# EAGLE design TR_i3_6A_Module_v10 (EAGLE 9.6.2)

## Sheet 1 of 2
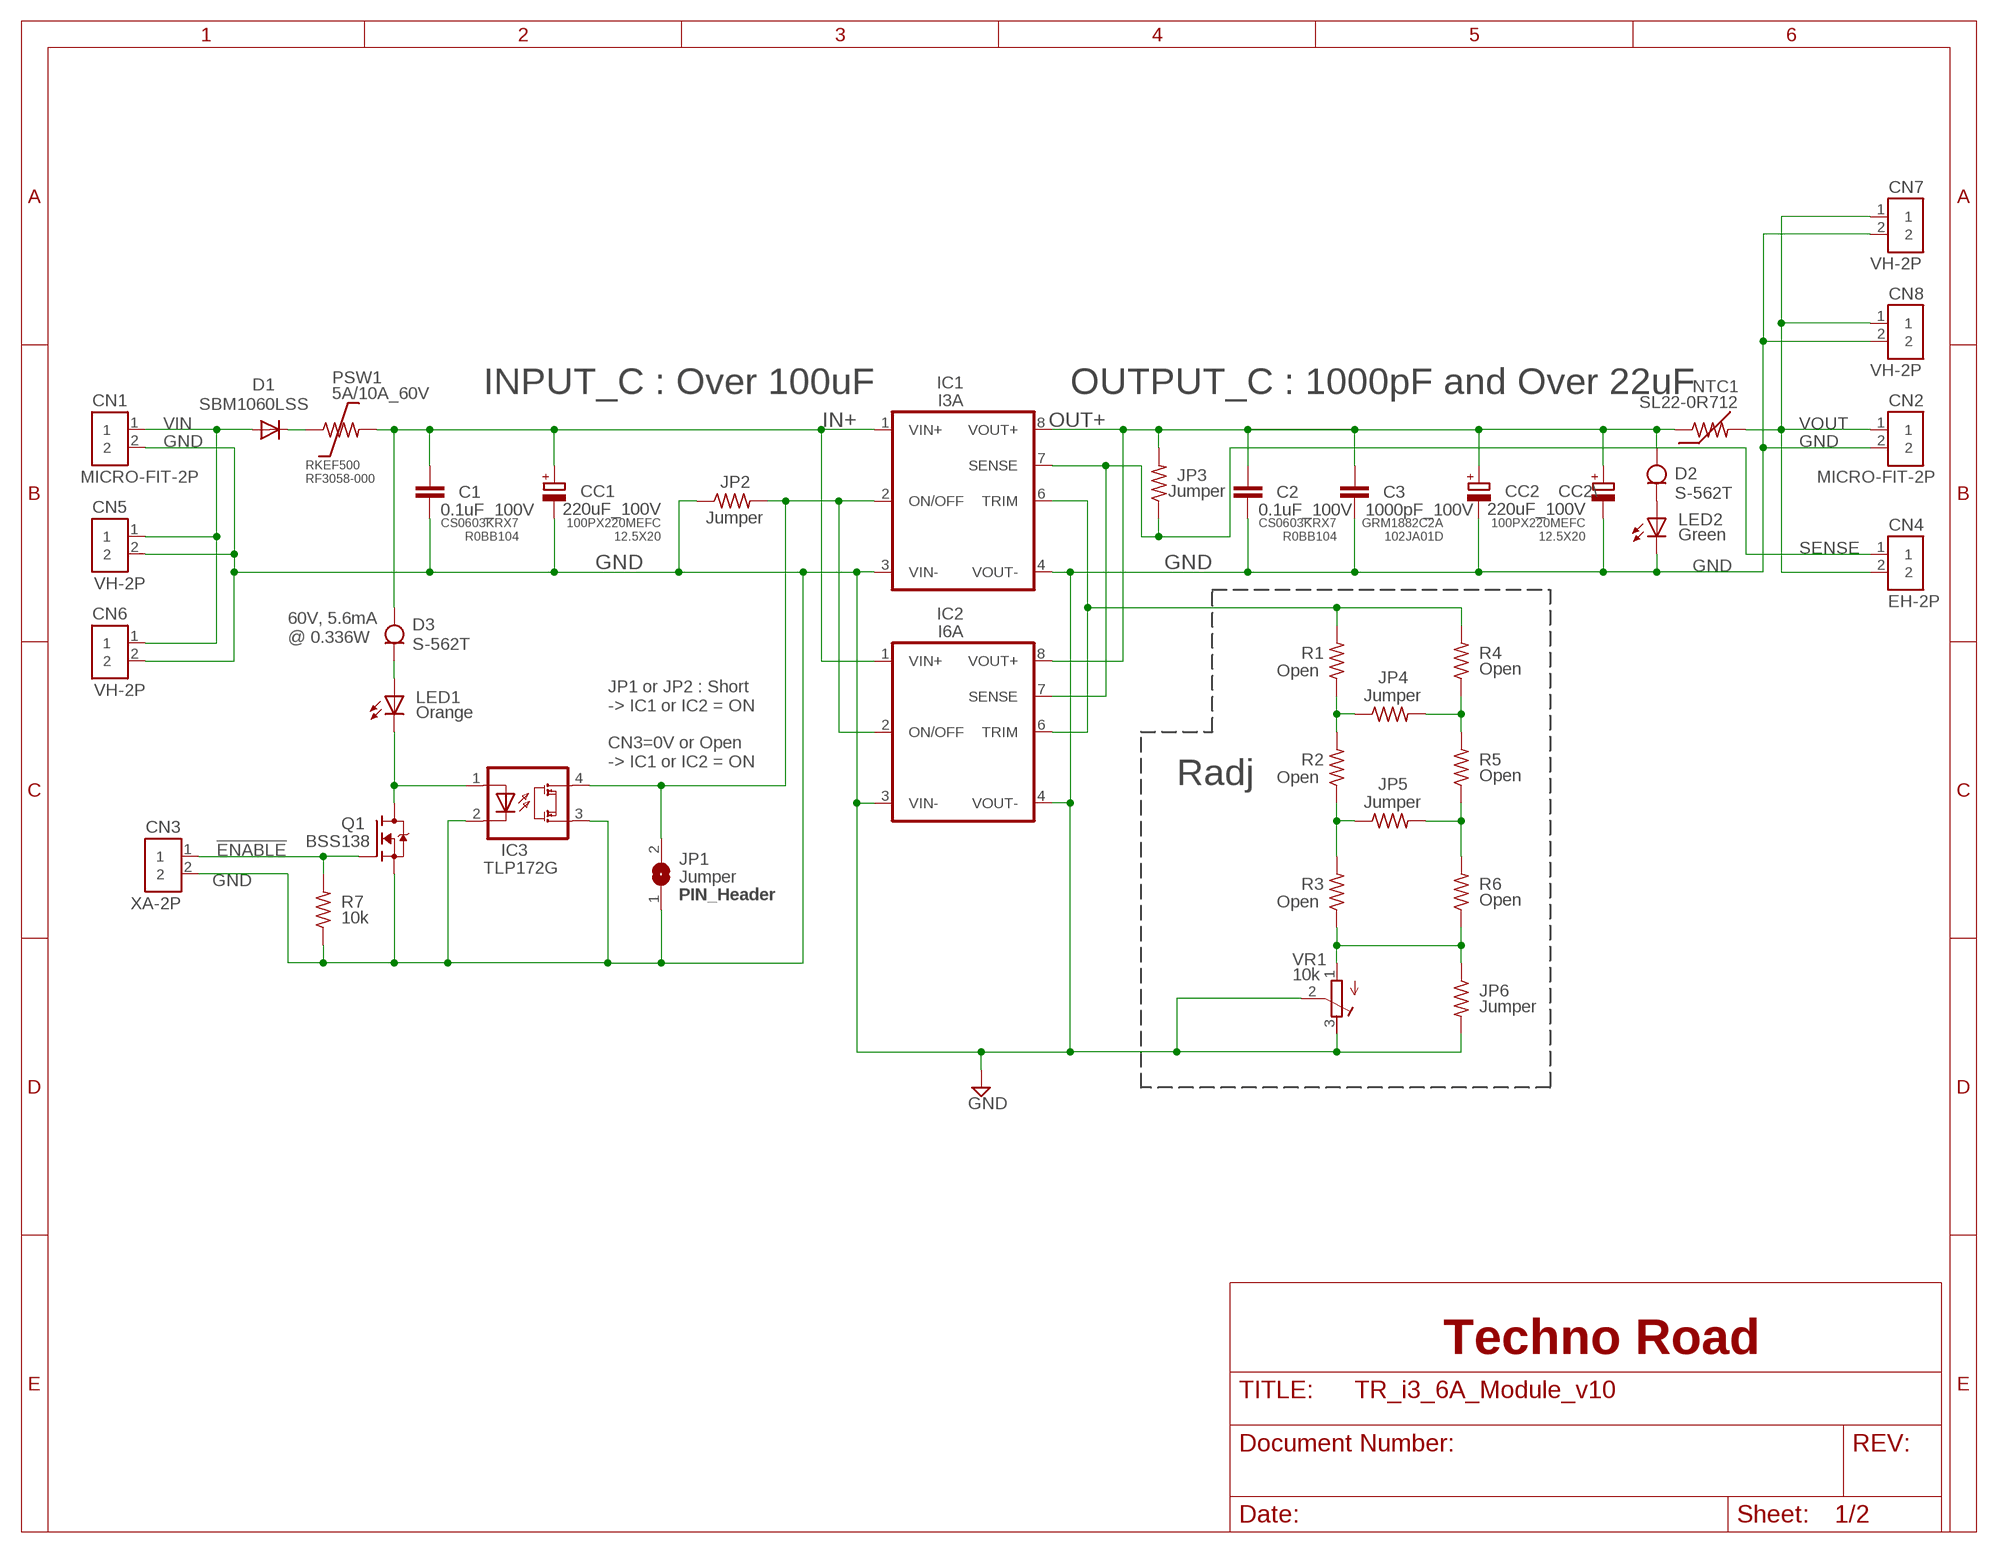
[diagram p0: schematic, sheet 1]

### Parts
C1  0.1uF_100V  C1608  [C1608]
C2  0.1uF_100V  C1608  [C1608]
C3  1000pF_100V  C1608  [C1608]
CC1  220uF_100V  CC0510  [CC0510]
CC2  220uF_100V  CC0510  [CC0510]
CC2\  CPOL-EUE7.5-16  [E7,5-16]
CN1  MICRO-FIT-2P  2PMICRO-FIT  [MICRO-FIT-2T]
CN2  MICRO-FIT-2P  2PMICRO-FIT  [MICRO-FIT-2T]
CN3  XA-2P  2PXA_NH  [XA-2P_NH]
CN4  EH-2P  2PEH  [EH-2P]
CN5  VH-2P  2PVH  [VH-2P]
CN6  VH-2P  2PVH  [VH-2P]
CN7  VH-2P  2PVH  [VH-2P]
CN8  VH-2P  2PVH  [VH-2P]
D1  SBM1060LSS  D12.7  [12.7MM]
D2  S-562T  CRDS-XXXT  [S-XXXT]
D3  S-562T  CRDS-XXXT  [S-XXXT]
IC1  I3A  I3A/I6A_SEREISI3A  [I3A_SERIES]
IC2  I6A  I3A/I6A_SEREISI6A  [I6A_SERIES]
IC3  TLP172G  TLP172  [11-5H1]
JP1  Jumper  JP1D  [JP1D_HOLE]
JP2  Jumper  R1608_LARGE_PAD  [R1608_LARGE_PAD]
JP3  Jumper  R1608_LARGE_PAD  [R1608_LARGE_PAD]
JP4  Jumper  R1608_LARGE_PAD  [R1608_LARGE_PAD]
JP5  Jumper  R1608_LARGE_PAD  [R1608_LARGE_PAD]
JP6  Jumper  R1608_LARGE_PAD  [R1608_LARGE_PAD]
LED1  Orange  LEDSML0603  [SML1608]
LED2  Green  LEDSML0603  [SML1608]
NTC1  SL22-0R712  NTCSL22  [SL22]
PSW1  5A/10A_60V  PSW10.16MM_4MM  [PSW-10.16MM_4MM]
Q1  BSS138  [SOT-23-3]
R1  Open  R1608_LARGE_PAD  [R1608_LARGE_PAD]
R2  Open  R1608_LARGE_PAD  [R1608_LARGE_PAD]
R3  Open  R1608_LARGE_PAD  [R1608_LARGE_PAD]
R4  Open  R1608_LARGE_PAD  [R1608_LARGE_PAD]
R5  Open  R1608_LARGE_PAD  [R1608_LARGE_PAD]
R6  Open  R1608_LARGE_PAD  [R1608_LARGE_PAD]
R7  10k  R1608_LARGE_PAD  [R1608_LARGE_PAD]
VR1  10k  R-TRIM3361P  [3361P]

### Nets
!ENABLE: CN3.1 Q1.1(G) R7.2
D_PSW: D1.2(C) PSW1.1
GND: C1.2 C2.2 C3.2 CC1.- CC2.- CC2\.- CN1.2 CN2.2 CN3.2 CN5.2 CN6.2 CN7.2 CN8.2 IC1.3(VIN-) IC1.4(VOUT-) IC2.3(VIN-) IC2.4(VOUT-) IC3.2(C1) IC3.3(DRN1) JP1.1 JP2.1 JP6.2 LED2.C Q1.2(S) R7.1 VR1.2(S) VR1.3(E)
IN+: C1.1 CC1.+ D3.A IC1.1(VIN+) IC2.1(VIN+) PSW1.2
N$1: JP6.1 R3.1 R6.1 VR1.1(A)
N$2: JP4.1 R1.1 R2.2
N$3: JP5.1 R2.1 R3.2
N$4: IC1.2(ON/OFF) IC2.2(ON/OFF) IC3.4(DRN2) JP1.2 JP2.2
N$5: D2.C LED2.A
N$6: D3.C LED1.A
N$7: IC1.6(TRIM) IC2.6(TRIM) R1.2 R4.2
N$8: JP4.2 R4.1 R5.2
N$9: JP5.2 R5.1 R6.2
N$10: IC3.1(A1) LED1.C Q1.3(D)
OUT+: C2.1 C3.1 CC2.+ CC2\.+ D2.A IC1.8(VOUT+) IC2.8(VOUT+) JP3.2 NTC1.1
SENSE: CN4.1 IC1.7(SENSE) IC2.7(SENSE) JP3.1
VIN: CN1.1 CN5.1 CN6.1 D1.1(A)
VOUT: CN2.1 CN4.2 CN7.1 CN8.1 NTC1.2

### Notes on the sheet
- INPUT_C : Over 100uF | OUTPUT_C : 1000pF and Over 22uF
- RKEF500
  RF3058-000
- CS0603KRX7
  R0BB104
- 100PX220MEFC
  12.5X20
- CS0603KRX7
  R0BB104
- GRM1882C2A
  102JA01D
- 100PX220MEFC
  12.5X20
- 60V, 5.6mA
  @ 0.336W
- JP1 or JP2 : Short
  -> IC1 or IC2 = ON
  
  CN3=0V or Open
  -> IC1 or IC2 = ON
- Radj
- PIN_Header
- Techno Road

## Sheet 2 of 2

## Library data of the parts
C1-C3 = my_rcl:C
CC1 CC2 = my_rcl:CC
CC2\ = rcl:CPOL-EU: POLARIZED CAPACITOR, European symbol
CN1-CN8 = my_con:2P
D1 = my_diode:D
D2 D3 = my_diode:CRD
IC1 IC2 = my_reg:I3A/I6A_SEREIS
IC3 = Original_Library:TLP172
JP1 = my_jumper:JP1D
JP2-JP6 R1-R7 = my_rcl:R
LED1 LED2 = my_led:LED
NTC1 = Original_Library:NTC
PSW1 = Original_Library:PSW
Q1 = my_tr:BSS138
VR1 = my_rcl:R-TRIM

## Board
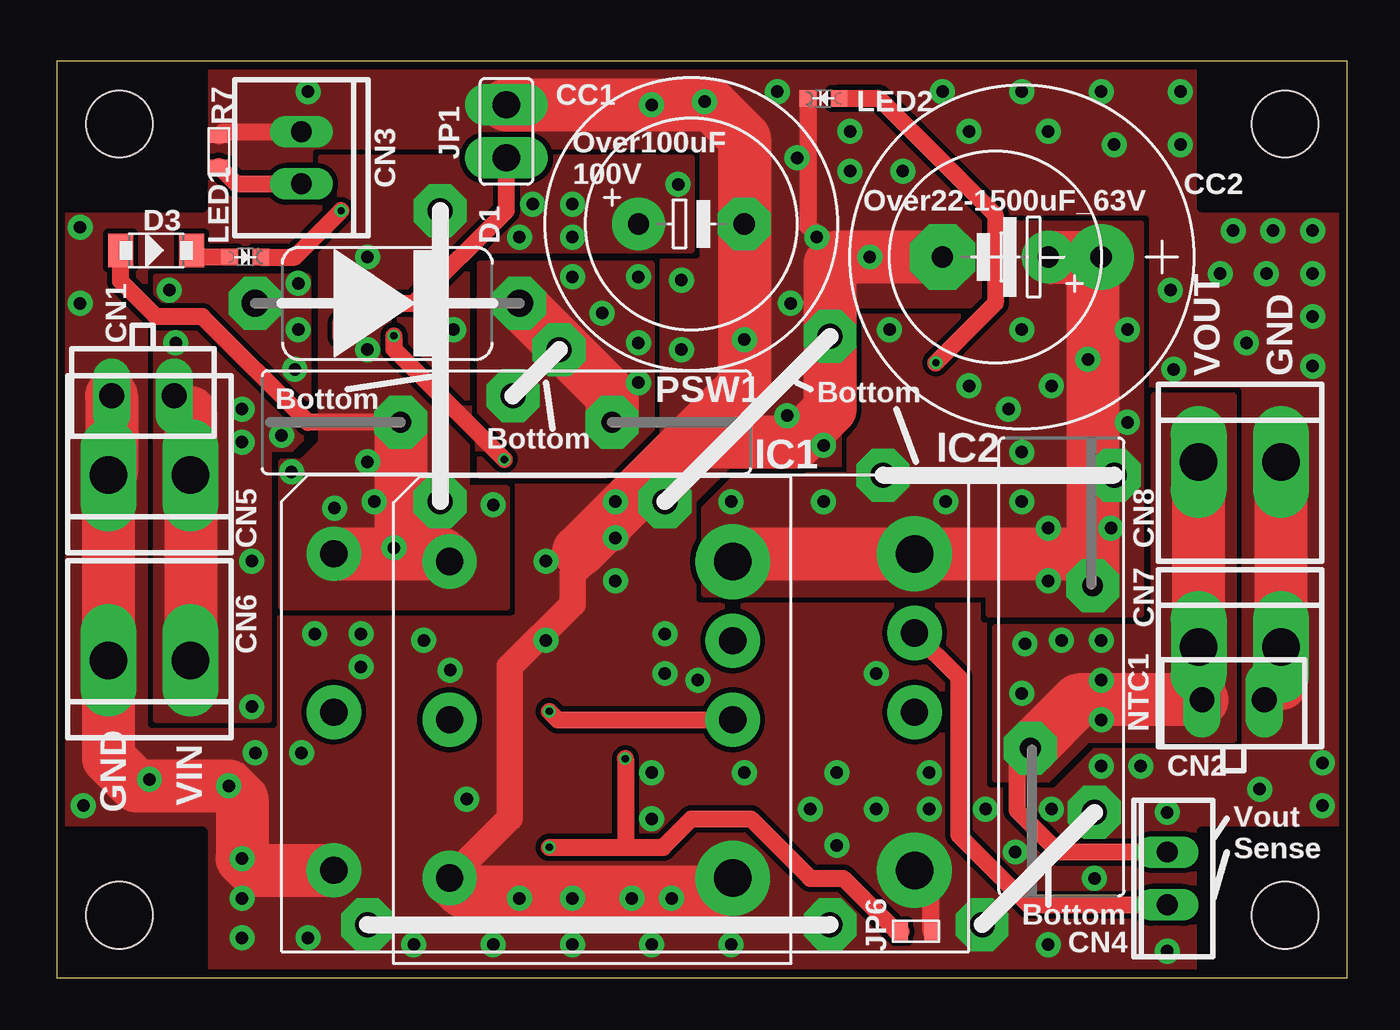
[diagram p1: board, top side]
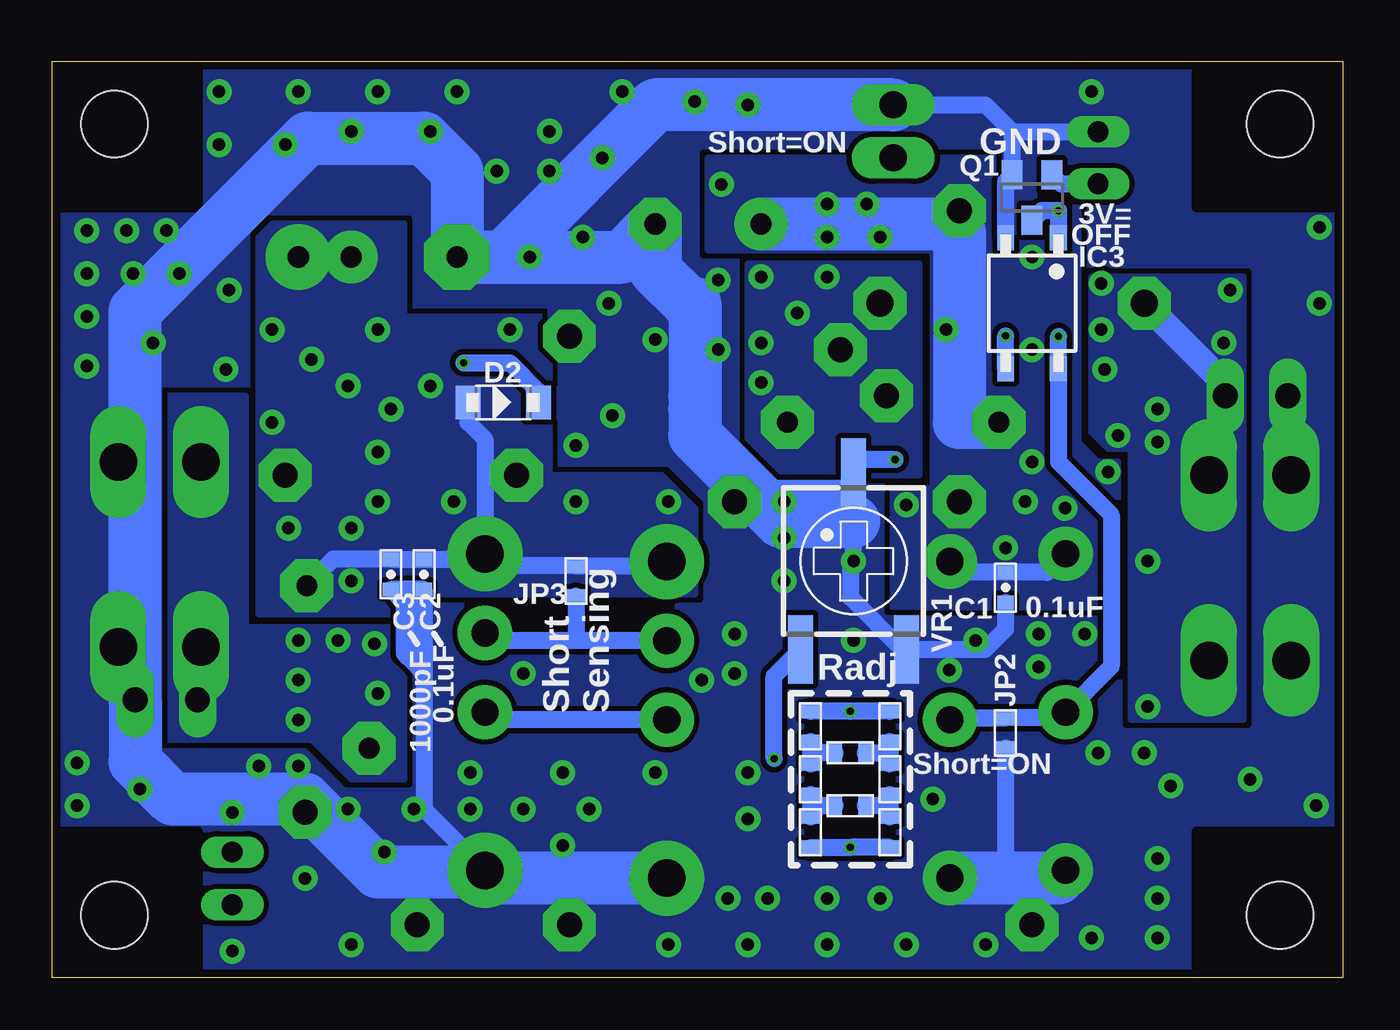
[diagram p2: board, bottom side, seen from below]

Size 62 x 44 mm. Coordinates in mm from the lower left corner, seen from the top.
Outline: 0,0 62,0 62,44 0,44 0,0
Copper layers (1*16): Top 0.035mm / dielectric 1.5mm / Bottom 0.035mm
Design rules "forSmallBoard_20191021_35um": minimum track width 0.2mm, minimum drill 0.25mm, track to track 0.2mm, track to pad 0.2mm, pad to pad 0.2mm, via to via 0.2mm, smd to smd 0mil, copper to edge 0.4mm, drill to drill 6mil, minimum pad ring 10mil, minimum via ring 5mil, stop-mask expansion 4mil, vias tented up to drill 0.5mm, thermal gap 10mil
Holes 3.2 mm at 3,3 59,3 59,41 3,41
tRestrict: area -1,37 to 7,45; area -1,-1 to 7,7; area 55,-1 to 63,7; area 55,37 to 63,45
bRestrict: area -1,37 to 7,45; area 55,37 to 63,45; area 55,-1 to 63,7; area -1,-1 to 7,7

### Footprints (pad centres in the part's own frame; a part is rotated, then mirrored left to right if it is on the bottom)
C1608 = smd 0.65 x 0.8: 1 -0.725,0; 2 0.725,0
CC0510 = drill 1.016 pad 2.54: + -2.54,0 | drill 1.016 pad 2.54 octagon: - 2.54,0
E7,5-16 = drill 1.016 pad 3.15: + -3.81,0 | drill 1.016 pad 3.15 octagon: - 3.81,0
MICRO-FIT-2T = drill 1.2 pad 1.676 long: 1 1.5,0; 2 -1.5,0
XA-2P_NH = drill 1 long: 1 1.25,0; 2 -1.25,0
EH-2P = drill 1 long: 1 -1.27,0; 2 1.27,0
VH-2P = drill 1.8 long: 1 -1.98,0; 2 1.98,0
12.7MM = drill 1.3 pad 2.54 octagon: 1 -6.35,0; 2 6.35,0
S-XXXT = smd 1.2 x 1.6: A 1.7,0; C -1.7,0
I3A_SERIES = drill 1.3 pad 2.6: 1 -6.85,7.6; 2 -6.85,0; 3 -6.85,-7.6; 6 6.75,0; 7 6.75,3.8 | drill 1.8 pad 3.6: 4 6.75,-7.6; 8 6.75,7.6
I6A_SERIES = drill 1.3 pad 2.6: 1 -14,7.65; 2 -14,0.05; 3 -14,-7.55; 6 13.9,0.05; 7 13.9,3.85 | drill 1.8 pad 3.6: 4 13.9,-7.55; 8 13.9,7.65
11-5H1 = smd 0.8 x 1.2: 1 -1.27,-3.15; 2 1.27,-3.15; 3 1.27,3.15; 4 -1.27,3.15
JP1D_HOLE = drill 1.3 pad 2 long: 1 -1.27,0; 2 1.27,0
R1608_LARGE_PAD = smd 0.65 x 0.9: 1 -0.725,0; 2 0.725,0
SML1608 = smd 0.8 x 0.8: A 0.75,0; C -0.75,0
SL22 = drill 1 pad 2.54 octagon: 1 -3.9,1.5; 2 3.9,-1.5
PSW-10.16MM_4MM = drill 1 pad 2.54 octagon: 1 -5.08,0; 2 5.08,0
SOT-23-3 = smd 1 x 1.4: 1 -0.95,-1.1; 2 0.95,-1.1; 3 0,1.1
3361P = smd 1.2 x 3.3: 1 -2.54,-4.25; 2 0,4.25; 3 2.54,-4.25

### Placement (x,y rotation side)
C1  16.19,18.73 270 bottom
C2  44.13,19.37 270 bottom
C3  45.72,19.37 270 bottom
CC1  30.48,36.2 0 top
CC2  45.09,34.61 180 top
CC2\  46.35,34.61 180 top
CN1  4.13,27.94 0 top
CN2  56.52,13.34 180 top
CN3  11.75,39.37 270 top
CN4  53.34,4.76 90 top
CN5  4.45,24.13 180 top
CN6  4.45,15.24 180 top
CN7  56.83,15.88 0 top
CN8  56.83,24.77 0 top
D1  15.88,32.38 0 top
D2  40.32,27.62 180 bottom
D3  4.76,34.92 180 top
IC1  25.72,12.38 0 top
IC2  27.3,12.7 0 top
IC3  14.92,32.38 180 bottom
JP1  21.59,40.64 270 top
JP2  16.19,11.75 90 bottom
JP3  36.83,19.05 90 bottom
JP4  23.65,10.79 0 bottom
JP5  23.65,8.26 0 bottom
JP6  41.27,2.22 0 top
LED1  9.05,34.61 180 top
LED2  36.83,42.23 0 top
NTC1  48.26,14.92 270 top
PSW1  21.59,26.67 180 top
Q1  14.92,37.47 180 bottom
R1  25.56,12.06 90 bottom
R2  25.56,9.53 90 bottom
R3  25.56,6.99 90 bottom
R4  21.75,12.06 90 bottom
R5  21.75,9.53 90 bottom
R6  21.75,6.99 90 bottom
R7  7.78,39.69 270 top
VR1  23.5,20 0 bottom

### Tracks (layer width: path | path; a pad name or v marks a point on that pad's centre or on a via)
!ENABLE
  Top 0.813: CN3.1 8.62,38.12 R7.2
  Bottom 0.813: Q1.1 13.53,38.12 CN3.1
D_PSW  (via drill 0.6 pad 1.2, 1.2 pad 2.54)
  Top 2.54: D1.2 26.67,27.94 PSW1.1
  other vias: 26.19,31.91 27.94,33.66 27.94,30.48 27.94,28.57 24.13,30.16 21.91,27.94 24.77,33.66
  pour Bottom (isolate 0.254, no thermals): 20.32,34.29 28.57,34.29 28.57,24.13 20.32,24.13
  pour Top (isolate 0.254, no thermals): 20.32,34.29 20.32,24.13 28.57,24.13 28.57,34.29
GND  (via drill 0.35, 0.6 pad 1.2, 1.2 pad 2.54)
  Top 0.813: v21.49,24.89 16.19,30.19 v16.19,30.82 | JP1.1 20.95,42.55 | CC2.- 37.99,34.61 36.08,36.08 LED2.C | JP6.2 42,4.36 IC2.4 | R7.1 7.99,40.62 CN3.2
  Top 1.27: 18.89,4.78 IC1.3 21.75,7.66 21.75,14.92 24.77,17.94 24.77,19.37 26.51,21.11 v26.83,21.11 | 58.81,14.13 CN2.2
  Top 2.54: 30.48,25.88 33.02,28.42 CC1.- 33.02,40.32 31.43,41.91 JP1.1 | 30.48,25.88 25.08,20.48 | CC2.- 37.47,34.61 37.15,34.29 37.15,27.3 35.56,25.72 30.64,25.72 30.48,25.88 | CN8.2 CN7.2 58.81,14.13 | CN1.2 2.63,24.29 CN5.2 CN6.2 2.46,10.55 3.81,9.21 v8.26,9.21 8.89,8.57 v8.89,5.71 9.46,5.15 IC2.3 | IC1.3 19.52,4.13 31.81,4.13 IC1.4
  Bottom 0.813: IC3.2 16.19,38.24 Q1.2 15.87,40.62 | IC3.3 v16.19,30.82 | v21.49,24.89 23.5,24.89 VR1.2 23.5,23.5 25.72,23.5 | 23.5,21.91 v23.5,20 23.65,19.84 23.65,18.26 21.15,15.75 VR1.3 17.18,15.75 16.19,16.74 C1.2 | 25.72,21.91 25.72,23.5 | C2.2 C3.2 45.09,18.01 45.09,15.56 44.93,15.4 | C2.2 44.13,14.61 | 44.13,14.61 44.13,8.08 IC2.4 | JP2.1 16.19,5.1 15.88,4.78 | CC2.- 33.66,34.61 31.43,32.38 31.11,32.07 31.11,27.3 27.3,23.5 25.72,23.5 | 44.93,15.4 44.13,14.61 | C2.2 44.93,17.85 44.93,15.4 | 15.87,40.62 CN3.2 | JP1.1 17.16,41.91 15.87,40.62
  Bottom 2.54: IC1.3 15.88,4.78 13.67,4.78 IC2.3 13.27,5.15 | IC1.4 40.84,4.78 IC2.4 41.27,5.08 46.35,5.08 49.85,8.57 56.2,8.57 58.02,10.39 CN2.2 58.02,32.02 49.71,40.32 44.13,40.32 42.55,38.73 CC2.- | CC2.- 34.61,34.61 CC1.- 33.02,33.97 31.43,32.38 | 31.11,32.38 31.11,27.3 | 31.11,27.94 31.11,26.04 26.99,21.91 25.72,21.91 23.5,21.91 | JP1.1 33.02,41.91 40.32,34.61 CC2.-
  other vias: 60.33,35.88 58.42,35.88 56.52,35.88 55.88,33.81 58.1,33.81 60.33,33.81 60.33,31.75 50.16,42.55 53.98,42.55 53.98,40.01 42.55,42.55 34.61,42.55 38.1,40.64 38.1,38.73 36.83,25.56 1.11,36.04 1.27,8.26 4.45,9.53 9.53,10.79 8.89,3.81 8.89,1.91 12.06,1.91 11.75,10.79 14.92,2.54 17.14,1.59 20.95,1.59 32.38,1.59 37.47,9.84 41.91,9.84 41.91,8.1 39.37,8.1 36.2,8.1 37.47,6.35 28.57,1.59 24.77,1.59 28.57,7.62 47.62,1.59 53.34,1.27 57.78,9.05 44.61,8.1 29.21,16.51 30.8,14.29 23.5,16.19 17.62,16.19 18.89,14.76 14.61,16.51 14.61,14.92 12.38,16.51 19.68,8.57 29.21,22.86 43.81,40.64 46.35,42.55 47.62,40.64 40.64,38.73 50.8,40.01 53.5,33.02 30,30.16 30,33.5 33.02,30.64 12.06,42.55 26.83,22.86 26.83,19.05 52.07,10.16 53.34,7.94 47.78,8.1 50.16,10.16 46.04,6.03 39.37,14.61 36.51,35.56 39.05,34.61 31.11,42.07 28.57,41.91 29.21,14.61 37.15,30.8 37.15,2.54 44.45,2.54 49.85,7.94 60.8,10.32 60.8,8.26 60.33,29.37 28.57,9.84 33.02,9.84 29.53,3.81 22.23,3.81 24.77,3.81 27.62,3.81 35.24,32.38 49.85,4.76 57.15,30.48 53.66,29.21 1.11,32.38 35.08,26.99 35.56,39.37
  pour Top (isolate 0.254, rank 2, no thermals): 0,0 62.23,0 62.23,44.13 0,44.13
  pour Bottom (isolate 0.254, rank 2, no thermals): 0,0 62.23,0 62.23,44.13 0,44.13
IN+  (via drill 0.6 pad 1.2, 1.2 pad 2.54)
  Top 0.813: PSW1.2 12.06,26.67 6.99,31.75 4.76,31.75 3.06,33.45 D3.A
  Top 2.54: IC2.1 16.51,20.35 | 16.51,20.35 18.5,20.35 IC1.1 | PSW1.2 16.51,20.35
  Bottom 0.813: IC1.1 18.34,19.46 C1.1 14.2,19.46 IC2.1
  Bottom 2.54: CC1.+ 18.73,36.2 18.41,35.88 18.41,26.67 PSW1.2
  other vias: 14.92,34.61 14.92,30.16 19.05,31.11 15.24,22.86 20.95,22.7 29.84,38.1 24.77,37.15 24.77,35.56 18.41,36.83 22.86,37.15 22.23,35.56 14.92,24.77 13.34,22.54 16.19,20.64 18.41,22.86 11.27,24.29
  pour Bottom (isolate 0.254, no thermals): 10.79,24.77 10.79,17.78 21.59,17.78 21.59,23.5 19.68,23.5 19.68,34.92 30.48,34.92 30.48,39.37 12.7,39.37 12.7,25.72 11.75,24.77
  pour Top (isolate 0.254, no thermals): 10.79,24.77 10.79,17.78 21.59,17.78 21.59,23.5 19.68,23.5 19.68,34.92 30.48,34.92 30.48,39.37 12.7,39.37 12.7,25.72 11.75,24.77
N$1  (via drill 0.35)
  Top 0.813: v23.65,6.26 27.3,6.26 | v27.3,10.51 27.3,6.26 | 27.3,6.26 29.12,6.26 30.48,7.62 33.34,7.62 36.2,4.76 37.78,4.76 40.32,2.22 JP6.1
  Bottom 0.813: R6.1 v23.65,6.26 R3.1 | v27.3,10.51 27.3,14.48 VR1.1
N$2
  Bottom 0.813: R1.1 25.56,10.79 | 25.56,10.79 R2.2 | JP4.1 25.56,10.79
N$3
  Bottom 0.813: R2.1 25.56,8.26 | 25.56,8.26 R3.2 | JP5.1 25.56,8.26
N$4  (via drill 0.35)
  Top 0.813: v13.65,30.8 13.65,31.43 14.61,32.38 17.14,32.38 21.59,36.83 JP1.2
  Bottom 0.813: IC1.2 18.78,12.47 JP2.2 13.58,12.47 IC2.2 11.11,14.94 11.11,22.23 13.65,24.77 IC3.4 v13.65,30.8
N$5  (via drill 0.35)
  Top 0.813: LED2.A 39.48,42.23 45.09,36.63 45.09,32.38 v42.23,29.53
  Bottom 0.813: D2.C 38.62,28.14 40.01,29.53 v42.23,29.53
N$6
  Top 0.813: LED1.A 6.78,34.61 D3.C
N$7  (via drill 0.35)
  Top 0.813: v23.65,12.79 24.06,12.38 IC1.6
  Bottom 0.813: R4.2 v23.65,12.79 R1.2 | IC1.6 40.84,12.38 IC2.6
N$8
  Bottom 0.813: R4.1 21.75,10.79 | 21.75,10.79 R5.2 | JP4.2 21.75,10.79
N$9
  Bottom 0.813: R5.1 21.75,8.26 | 21.75,8.26 R6.2 | 21.75,8.26 JP5.2
N$10  (via drill 0.35)
  Top 0.813: v13.65,36.83 11.43,34.61 LED1.C
  Bottom 0.813: IC3.1 v13.65,36.83 14.46,36.83 Q1.3
OUT+  (via drill 0.6 pad 1.2, 1.2 pad 2.54)
  Top 2.54: IC1.8 32.84,20.35 IC2.8 49.76,20.35 | CC2.+ CC2\.+ | 49.61,34.61 CC2\.+ | CC2\.+ 49.76,34.61 49.76,20.35 | 49.76,20.35 NTC1.1
  Bottom 0.813: IC1.8 32.67,19.77 JP3.2 40.63,19.77 IC2.8 | IC2.8 41.46,20.09 C2.1 C3.1 48.49,20.09 NTC1.1 | D2.A 42.02,26.67 41.2,25.85 IC2.8
  other vias: 40.01,31.11 43.81,28.42 45.72,27.3 50.64,21.59 50.8,24.13 51.44,26.67 47.62,21.59 42.7,22.86 32.38,22.86 36.83,22.86 47.78,28.42 46.35,31.11 49.53,29.69 51.44,31.11 47.62,19.05 46.35,25.24 46.35,22.86 39.69,24.13
  pour Bottom (isolate 0.254, no thermals): 38.1,31.75 45.09,31.75 45.09,36.2 52.07,36.2 52.07,17.46 44.77,17.46 44.77,18.41 31.11,18.41 31.11,22.54 32.7,24.13 38.1,24.13
  pour Top (isolate 0.254, no thermals): 32.7,24.13 31.11,22.54 31.11,18.41 44.77,18.41 44.77,17.46 52.07,17.46 52.07,36.2 45.09,36.2 45.09,31.75 38.1,31.75 38.1,24.13
SENSE
  Top 0.813: IC2.7 43.34,14.42 43.34,6.83 46.67,3.49 CN4.1
  Bottom 0.813: IC1.7 36.83,16.18 | 36.83,16.18 40.84,16.18 IC2.7 | JP3.1 36.83,16.18
VIN  (via drill 0.6 pad 1.2)
  Top 1.27: CN1.1 6.42,27.14
  Top 2.54: 6.42,27.14 CN5.1 CN6.1
  Bottom 1.27: D1.1 5.63,28.49 CN1.1
  other vias: 8.89,25.72 11.59,31.11 10.79,26.04 11.59,33.34 5.4,33.02 8.89,27.3 9.37,20 5.71,30.48 11.43,29.21 9.37,13.02
  pour Top (isolate 0.254, no thermals): 4.76,33.66 12.06,33.66 12.06,26.19 11.27,25.4 10.16,25.4 10.16,12.38 4.76,12.38
  pour Bottom (isolate 0.254, no thermals): 4.76,33.66 4.76,12.38 10.16,12.38 10.16,25.4 11.27,25.4 12.06,26.19 12.06,33.66
VOUT  (via drill 0.6 pad 1.2)
  Top 0.813: NTC1.2 46.12,10.39 46.12,8.05 48.14,6.03 CN4.2
  Top 2.54: 46.83,11.02 NTC1.2 49.07,13.34 CN2.1 54.85,13.5 CN7.1 CN8.1
  other vias: 48.26,16.19 50.16,12.38 46.51,16.03 50.16,16.19 46.35,13.65 50.16,14.29
  pour Top (isolate 0.254, no thermals): 52.7,27.94 56.52,27.94 56.52,11.43 49.53,11.43 47.62,9.53 45.09,9.53 45.09,16.83 52.7,16.83
  pour Bottom (isolate 0.254, no thermals): 52.7,27.94 56.52,27.94 56.52,11.43 49.53,11.43 47.62,9.53 45.09,9.53 45.09,16.83 52.7,16.83

### Text on the board
tNames: Over100uF / 100V | Over22-1500uF_63V | VOUT | GND | Bottom | Bottom | Bottom | GND | VIN | Vout / Sense | Bottom
bNames: GND | Short=ON | OFF | 3V= | 0.1uF | Radj | Short / Sensing | 0.1uF | Short=ON | 1000pF